# Altium schematic sheet ECAL.SchDoc
size A; SheetNumber: 3; SheetTotal: 5
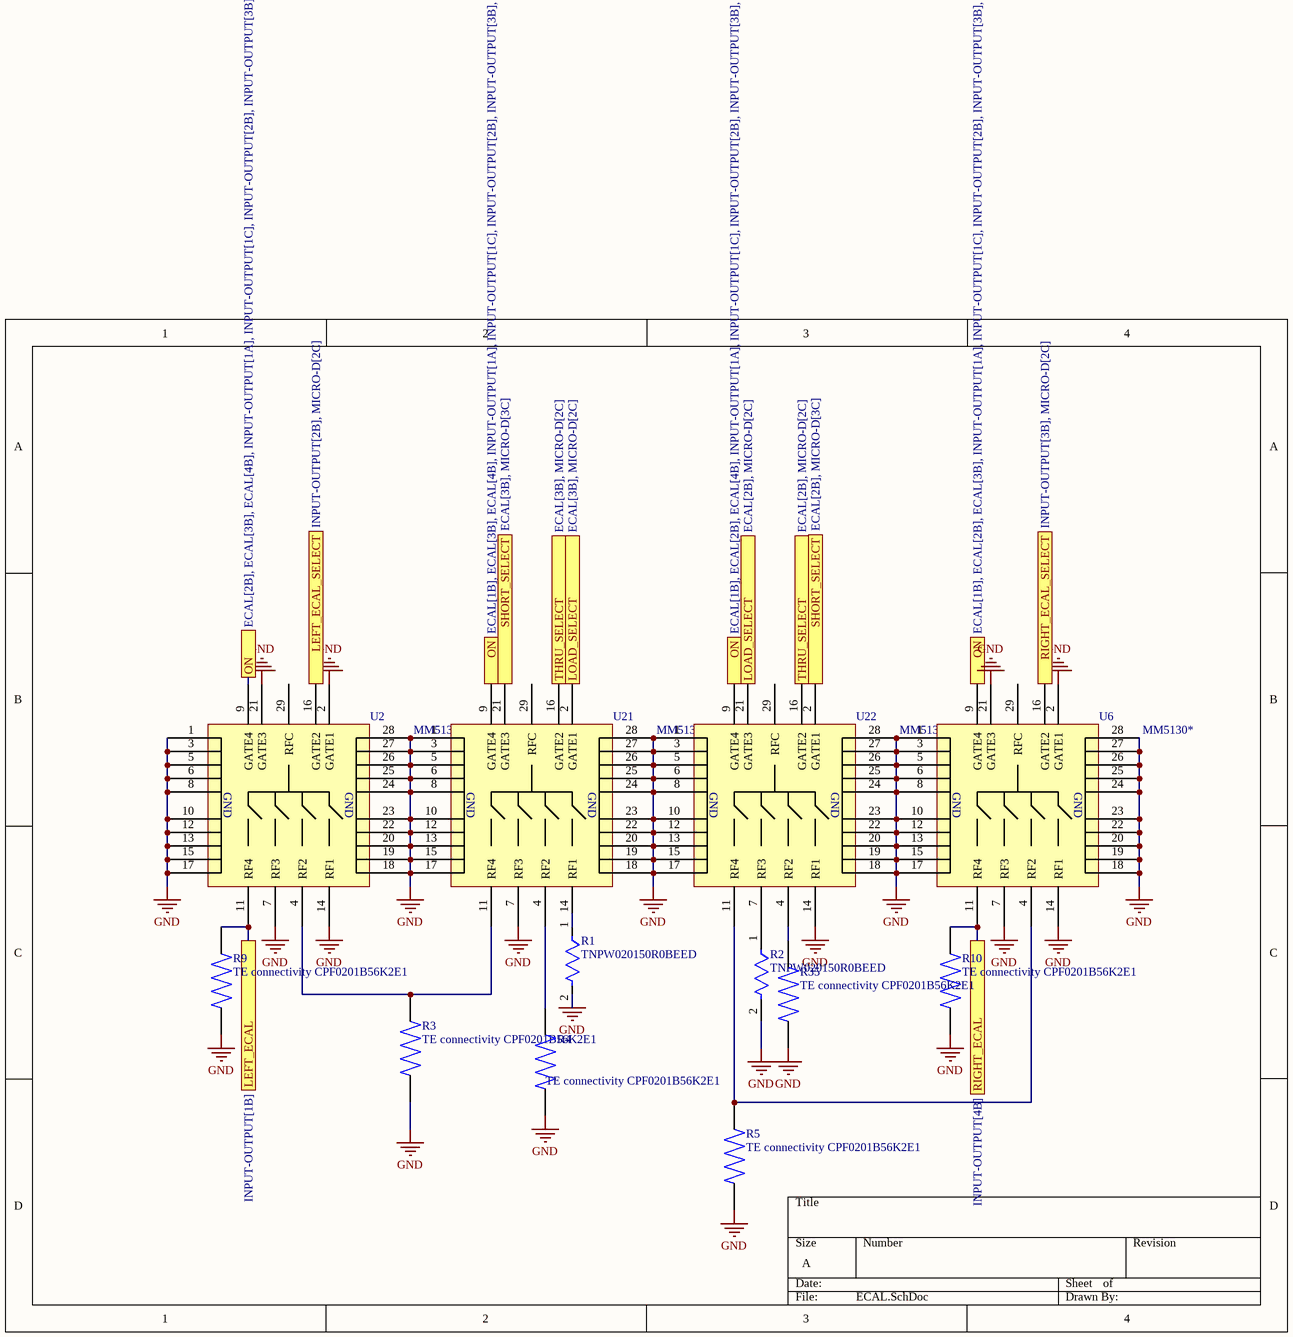
[diagram p0: ECAL.SchDoc]

## Parts
R1  TNPW020150R0BEED  [FP-ERJ1GN-IPC_C]
R2  TNPW020150R0BEED  [FP-ERJ1GN-IPC_C]
R3  TE connectivity CPF0201B56K2E1  [0201-resistor]
R4  TE connectivity CPF0201B56K2E1  [0201-resistor]
R5  TE connectivity CPF0201B56K2E1  [0201-resistor]
R9  TE connectivity CPF0201B56K2E1  [0201-resistor]
R10  TE connectivity CPF0201B56K2E1  [0201-resistor]
R35  TE connectivity CPF0201B56K2E1  [0201-resistor]
U2  MM5130*  [MM5130-NORM_PCB_NOFLOOD]
U6  MM5130*  [MM5130-NORM_PCB_NOFLOOD]
U21  MM5130*  [MM5130-NORM_PCB_NOFLOOD]
U22  MM5130*  [MM5130-NORM_PCB_NOFLOOD]

## Ports
LEFT_ECAL (see INPUT-OUTPUT[1B]), LEFT_ECAL_SELECT (see INPUT-OUTPUT[2B], MICRO-D[2C]), LOAD_SELECT (see ECAL[2B], MICRO-D[2C]), LOAD_SELECT (see ECAL[3B], MICRO-D[2C]), ON (see ECAL[1B], ECAL[2B], ECAL[3B], INPUT-OUTPUT[1A], INPUT-OUTPUT[1C], INPUT-OUTPUT[2B], INPUT-OUTPUT[3B], INPUT-OUTPUT[4A], INPUT-OUTPUT[4C], LEFT-ISOLATION[1A], LEFT-ISOLATION[1C], LEFT-ISOLATION[2A], LEFT-ISOLATION[2C], LEFT-ISOLATION[3A], LEFT-ISOLATION[3C], MICRO-D[2C], RIGHT-ISOLATION[2A], RIGHT-ISOLATION[2C], RIGHT-ISOLATION[3A], RIGHT-ISOLATION[3C]), ON (see ECAL[1B], ECAL[2B], ECAL[4B], INPUT-OUTPUT[1A], INPUT-OUTPUT[1C], INPUT-OUTPUT[2B], INPUT-OUTPUT[3B], INPUT-OUTPUT[4A], INPUT-OUTPUT[4C], LEFT-ISOLATION[1A], LEFT-ISOLATION[1C], LEFT-ISOLATION[2A], LEFT-ISOLATION[2C], LEFT-ISOLATION[3A], LEFT-ISOLATION[3C], MICRO-D[2C], RIGHT-ISOLATION[2A], RIGHT-ISOLATION[2C], RIGHT-ISOLATION[3A], RIGHT-ISOLATION[3C]), ON (see ECAL[1B], ECAL[3B], ECAL[4B], INPUT-OUTPUT[1A], INPUT-OUTPUT[1C], INPUT-OUTPUT[2B], INPUT-OUTPUT[3B], INPUT-OUTPUT[4A], INPUT-OUTPUT[4C], LEFT-ISOLATION[1A], LEFT-ISOLATION[1C], LEFT-ISOLATION[2A], LEFT-ISOLATION[2C], LEFT-ISOLATION[3A], LEFT-ISOLATION[3C], MICRO-D[2C], RIGHT-ISOLATION[2A], RIGHT-ISOLATION[2C], RIGHT-ISOLATION[3A], RIGHT-ISOLATION[3C]), ON (see ECAL[2B], ECAL[3B], ECAL[4B], INPUT-OUTPUT[1A], INPUT-OUTPUT[1C], INPUT-OUTPUT[2B], INPUT-OUTPUT[3B], INPUT-OUTPUT[4A], INPUT-OUTPUT[4C], LEFT-ISOLATION[1A], LEFT-ISOLATION[1C], LEFT-ISOLATION[2A], LEFT-ISOLATION[2C], LEFT-ISOLATION[3A], LEFT-ISOLATION[3C], MICRO-D[2C], RIGHT-ISOLATION[2A], RIGHT-ISOLATION[2C], RIGHT-ISOLATION[3A], RIGHT-ISOLATION[3C]), RIGHT_ECAL (see INPUT-OUTPUT[4B]), RIGHT_ECAL_SELECT (see INPUT-OUTPUT[3B], MICRO-D[2C]), SHORT_SELECT (see ECAL[2B], MICRO-D[3C]), SHORT_SELECT (see ECAL[3B], MICRO-D[3C]), THRU_SELECT (see ECAL[2B], MICRO-D[2C]), THRU_SELECT (see ECAL[3B], MICRO-D[2C])

## Nets
GND: R1.2 R2.2 R3.1 R4.1 R5.1 R9.1 R10.1 R35.1 U2.1(GND) U2.2(GATE1) U2.3(GND) U2.5(GND) U2.6(GND) U2.7(RF3) U2.8(GND) U2.10(GND) U2.12(GND) U2.13(GND) U2.14(RF1) U2.15(GND) U2.17(GND) U2.18(GND) U2.19(GND) U2.20(GND) U2.21(GATE3) U2.22(GND) U2.23(GND) U2.24(GND) U2.25(GND) U2.26(GND) U2.27(GND) U2.28(GND) U6.1(GND) U6.2(GATE1) U6.3(GND) U6.5(GND) U6.6(GND) U6.7(RF3) U6.8(GND) U6.10(GND) U6.12(GND) U6.13(GND) U6.14(RF1) U6.15(GND) U6.17(GND) U6.18(GND) U6.19(GND) U6.20(GND) U6.21(GATE3) U6.22(GND) U6.23(GND) U6.24(GND) U6.25(GND) U6.26(GND) U6.27(GND) U6.28(GND) U21.1(GND) U21.3(GND) U21.5(GND) U21.6(GND) U21.7(RF3) U21.8(GND) U21.10(GND) U21.12(GND) U21.13(GND) U21.15(GND) U21.17(GND) U21.18(GND) U21.19(GND) U21.20(GND) U21.22(GND) U21.23(GND) U21.24(GND) U21.25(GND) U21.26(GND) U21.27(GND) U21.28(GND) U22.1(GND) U22.3(GND) U22.5(GND) U22.6(GND) U22.8(GND) U22.10(GND) U22.12(GND) U22.13(GND) U22.14(RF1) U22.15(GND) U22.17(GND) U22.18(GND) U22.19(GND) U22.20(GND) U22.22(GND) U22.23(GND) U22.24(GND) U22.25(GND) U22.26(GND) U22.27(GND) U22.28(GND)
LEFT_ECAL: R9.2 U2.11(RF4) ; port LEFT_ECAL
LEFT_ECAL_SELECT: U2.16(GATE2) ; port LEFT_ECAL_SELECT
LOAD_SELECT: U21.2(GATE1) U22.21(GATE3) ; port LOAD_SELECT
ON: U2.9(GATE4) U6.9(GATE4) U21.9(GATE4) U22.9(GATE4) ; port ON
RIGHT_ECAL: R10.2 U6.11(RF4) ; port RIGHT_ECAL
RIGHT_ECAL_SELECT: U6.16(GATE2) ; port RIGHT_ECAL_SELECT
SHORT_SELECT: U21.21(GATE3) U22.2(GATE1) ; port SHORT_SELECT
THRU_SELECT: U21.16(GATE2) U22.16(GATE2) ; port THRU_SELECT
NetR1_1: R1.1 U21.14(RF1)
NetR2_1: R2.1 U22.7(RF3)
NetR3_2: R3.2 U2.4(RF2) U21.11(RF4)
NetR4_2: R4.2 U21.4(RF2)
NetR5_2: R5.2 U6.4(RF2) U22.11(RF4)
NetR35_2: R35.2 U22.4(RF2)

Not connected (* = marked no-connect by the designer): U2 29(RFC); U6 29(RFC); U21 29(RFC); U22 29(RFC)

## Library data of the parts
R1 R2 = CMP-1010-00416-3: RES SMD 50 OHM 0.1% 1/20W 0201; Temperature Coefficient: 200ppm/°C; Resistance Tolerance: 1%; Max Power Dissipation: 50mW; Voltage Rating (DC): 25V; Resistance: 1kR; Number of Pins: 2; Height: 0.01inch; Weight: 6E-06oz; Min Operating Temperature: -55°C; Features: Automotive AEC-Q200; Radiation Hardening: No; Resistor Type: Thick Film; RoHS Compliant: Yes; Termination: SMD/SMT; Package Quantity: 15000; Size Code: 0201; Case Code (Imperial): 0201; Contact Plating: Tin; Case/Package: 0201; Lead Free: Lead Free; Number of Terminations: 2; Tolerance: 1%; Max Operating Temperature: 125°C; Mount: Surface Mount; Width: 0.012inch; Series: ERJ; Voltage Rating: 25V; Power Rating: 50mW; Packaging: Tape and Reel; Length: 0.6mm; Case Code (Metric): 0603
R3-R5 R9 R10 R35 = TE connectivity CPF0201B56K2E1: CPF 0201 56K2 0.1% 25PPM 1K RL; MP: ERJ1GN0R00C; Value: 56k; Availability: Unavailable; Price: None; Package: None; Mfgr: TE connectivity; Mfgr Part No.: CPF0201B56K2E1
U2 U6 U21 U22 = IC-MM5130: High power SP4T MEMs switch